# Altium schematic sheet module_led.SchDoc
size A4
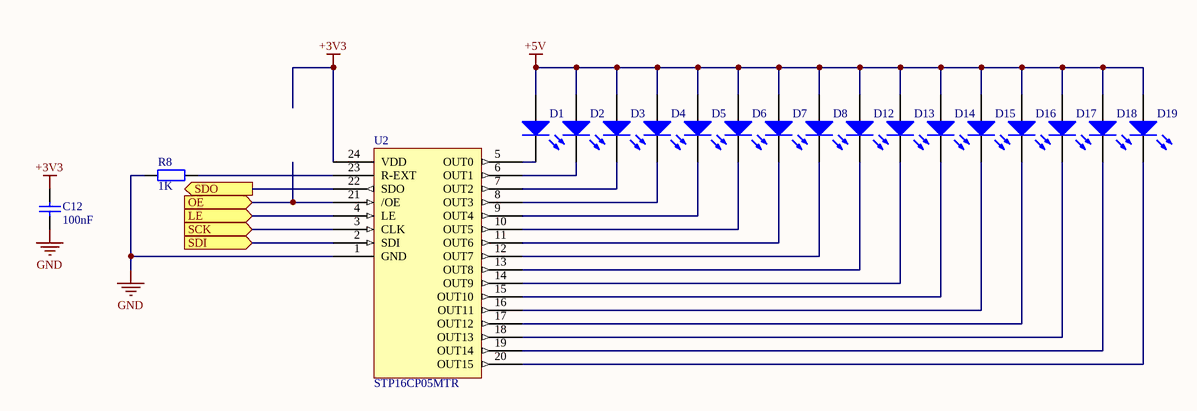
[diagram p0: module_led.SchDoc]

## Parts
C12  100nF  [FP_0805_CAP_085]
D1  LED  [FP_0805_LED_RED]  (value not drawn)
D2  LED  [FP_0805_LED_RED]  (value not drawn)
D3  LED  [FP_0805_LED_RED]  (value not drawn)
D4  LED  [FP_0805_LED_RED]  (value not drawn)
D5  LED  [FP_0805_LED_RED]  (value not drawn)
D6  LED  [FP_0805_LED_RED]  (value not drawn)
D7  LED  [FP_0805_LED_RED]  (value not drawn)
D8  LED  [FP_0805_LED_RED]  (value not drawn)
D12  LED  [FP_0805_LED_RED]  (value not drawn)
D13  LED  [FP_0805_LED_RED]  (value not drawn)
D14  LED  [FP_0805_LED_RED]  (value not drawn)
D15  LED  [FP_0805_LED_RED]  (value not drawn)
D16  LED  [FP_0805_LED_RED]  (value not drawn)
D17  LED  [FP_0805_LED_RED]  (value not drawn)
D18  LED  [FP_0805_LED_RED]  (value not drawn)
D19  LED  [FP_0805_LED_RED]  (value not drawn)
R8  value 1K  [FP_0805_RES]  (hidden comment: R_EL)
U2  STP16CP05MTR  [SOP24]

## Ports
LE (in), OE (in), SCK (in), SDI (in), SDO (out)

## Nets
+3V3: C12.2 U2.24(VDD)
+5V: D1.1(A) D2.1(A) D3.1(A) D4.1(A) D5.1(A) D6.1(A) D7.1(A) D8.1(A) D12.1(A) D13.1(A) D14.1(A) D15.1(A) D16.1(A) D17.1(A) D18.1(A) D19.1(A)
GND: C12.1 R8.2 U2.1(GND)
LE: U2.4(LE) ; port LE
OE: U2.21(/OE) ; port OE
SCK: U2.3(CLK) ; port SCK
SDI: U2.2(SDI) ; port SDI
SDO: U2.22(SDO) ; port SDO
NetD1_2: D1.2(K) U2.5(OUT0)
NetD2_2: D2.2(K) U2.6(OUT1)
NetD3_2: D3.2(K) U2.7(OUT2)
NetD4_2: D4.2(K) U2.8(OUT3)
NetD5_2: D5.2(K) U2.9(OUT4)
NetD6_2: D6.2(K) U2.10(OUT5)
NetD7_2: D7.2(K) U2.11(OUT6)
NetD8_2: D8.2(K) U2.12(OUT7)
NetD12_2: D12.2(K) U2.13(OUT8)
NetD13_2: D13.2(K) U2.14(OUT9)
NetD14_2: D14.2(K) U2.15(OUT10)
NetD15_2: D15.2(K) U2.16(OUT11)
NetD16_2: D16.2(K) U2.17(OUT12)
NetD17_2: D17.2(K) U2.18(OUT13)
NetD18_2: D18.2(K) U2.19(OUT14)
NetD19_2: D19.2(K) U2.20(OUT15)
NetR8_1: R8.1 U2.23(R-EXT)

## Library data of the parts
C12 = CAP 100nF: Capacitor; Voltage: 50V; Reference: 2407344; Supplier: Farnell; Value: 100nF
D1-D8 D12-D19 = LED: Typical RED GaAs LED; pin to pad: 1>A 2>K; Reference: 2099236; Name: LED, red; Supplier: Franell
R8 = RES: Resistor; Reference: R_LED
U2 = STP16CP05MTR: LED driver [16]; Reference: 1542235; ComponentLink1Description: Farnell; ComponentLink1URL: https://hu.farnell.com/stmicroelectronics/stp16cp05mtr/ic-sm-driver-led-sink-16-bit/dp/1542235; Supplier: Farnell